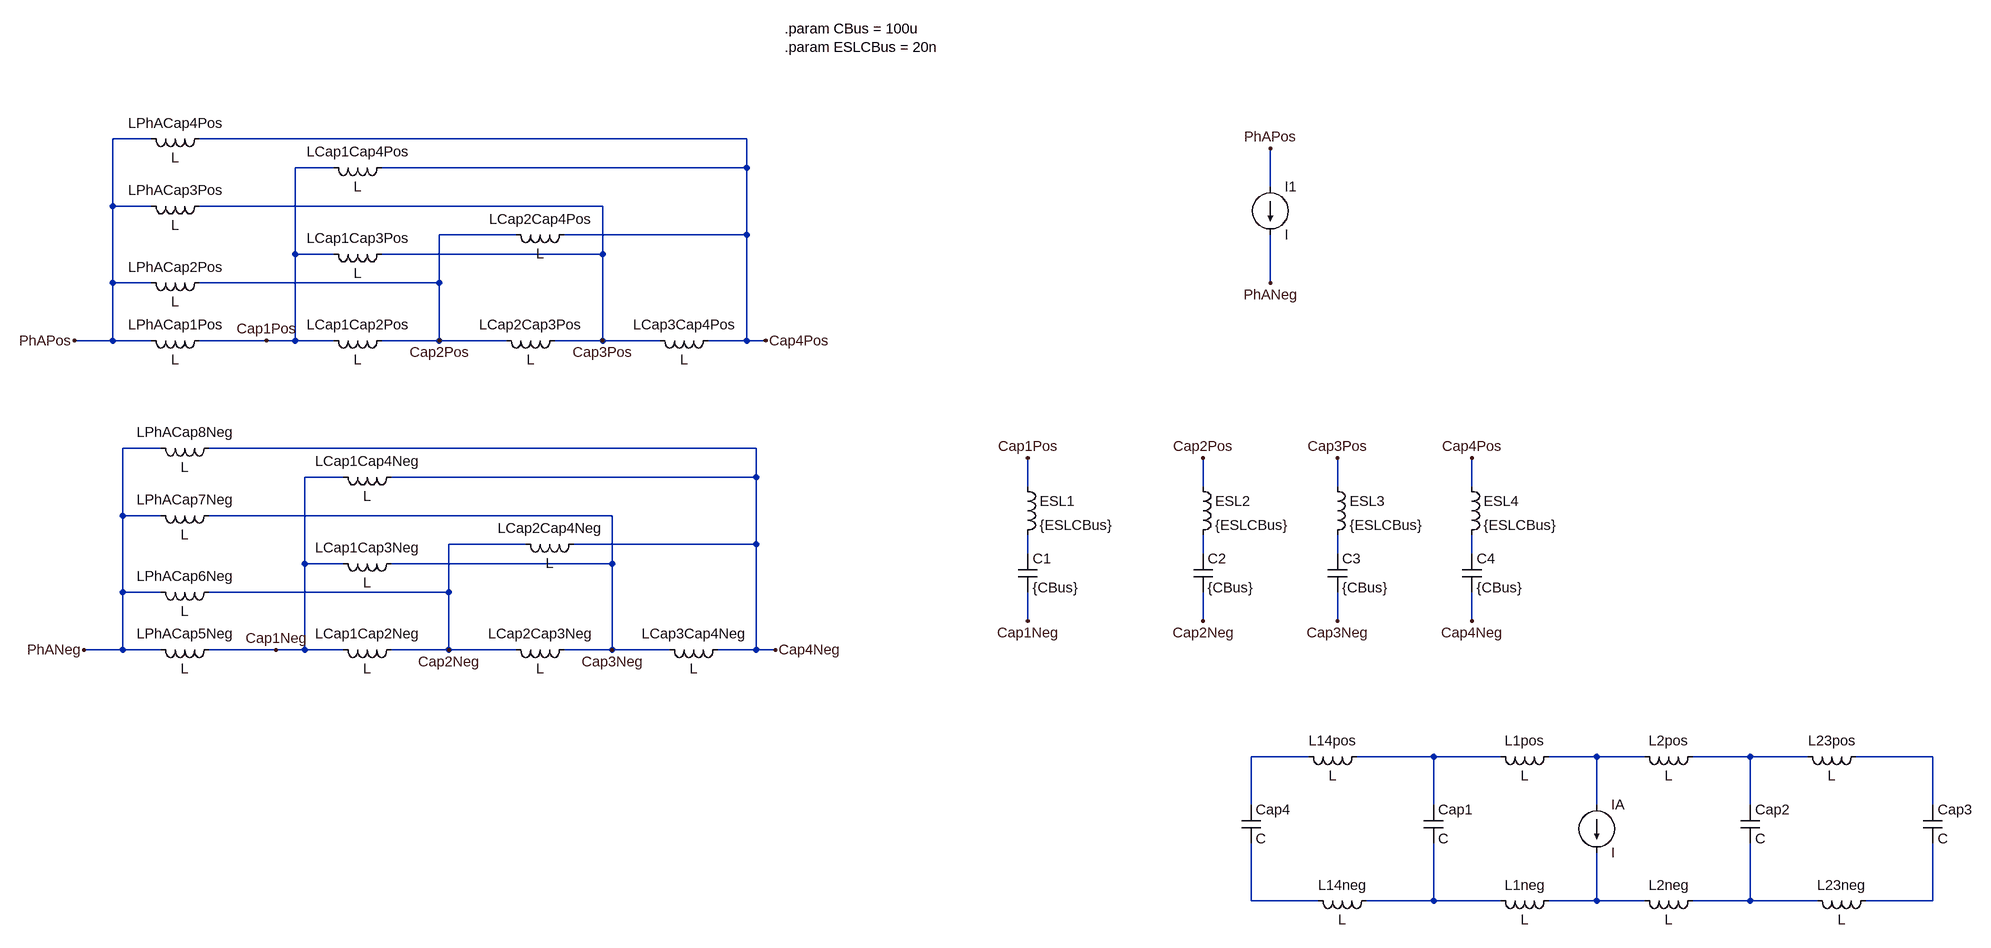
[diagram p0: schematic Draft1.asc]
Draft1.asc, the LTspice schematic file:
Version 4
SHEET 1 1544 2192
WIRE -1552 464 -1616 464
WIRE -560 464 -1472 464
WIRE -1248 512 -1312 512
WIRE -560 512 -560 464
WIRE -560 512 -1168 512
WIRE 368 544 368 480
WIRE -1616 576 -1616 464
WIRE -1552 576 -1616 576
WIRE -800 576 -1472 576
WIRE -944 624 -1072 624
WIRE -560 624 -560 512
WIRE -560 624 -864 624
WIRE -1312 656 -1312 512
WIRE -1248 656 -1312 656
WIRE -800 656 -800 576
WIRE -800 656 -1168 656
WIRE -1616 704 -1616 576
WIRE -1552 704 -1616 704
WIRE -1072 704 -1072 624
WIRE -1072 704 -1472 704
WIRE 368 704 368 624
WIRE -1616 800 -1616 704
WIRE -1616 800 -1680 800
WIRE -1552 800 -1616 800
WIRE -1360 800 -1472 800
WIRE -1312 800 -1312 656
WIRE -1312 800 -1360 800
WIRE -1248 800 -1312 800
WIRE -1072 800 -1072 704
WIRE -1072 800 -1168 800
WIRE -960 800 -1072 800
WIRE -800 800 -800 656
WIRE -800 800 -880 800
WIRE -704 800 -800 800
WIRE -560 800 -560 624
WIRE -560 800 -624 800
WIRE -528 800 -560 800
WIRE -1536 1088 -1600 1088
WIRE -544 1088 -1456 1088
WIRE -1232 1136 -1296 1136
WIRE -544 1136 -544 1088
WIRE -544 1136 -1152 1136
WIRE -48 1152 -48 1104
WIRE 256 1152 256 1104
WIRE 480 1152 480 1104
WIRE 704 1152 704 1104
WIRE -1600 1200 -1600 1088
WIRE -1536 1200 -1600 1200
WIRE -784 1200 -1456 1200
WIRE -928 1248 -1056 1248
WIRE -544 1248 -544 1136
WIRE -544 1248 -848 1248
WIRE -48 1264 -48 1232
WIRE 256 1264 256 1232
WIRE 480 1264 480 1232
WIRE 704 1264 704 1232
WIRE -1296 1280 -1296 1136
WIRE -1232 1280 -1296 1280
WIRE -784 1280 -784 1200
WIRE -784 1280 -1152 1280
WIRE -1600 1328 -1600 1200
WIRE -1536 1328 -1600 1328
WIRE -1056 1328 -1056 1248
WIRE -1056 1328 -1456 1328
WIRE -48 1376 -48 1328
WIRE 256 1376 256 1328
WIRE 480 1376 480 1328
WIRE 704 1376 704 1328
WIRE -1600 1424 -1600 1328
WIRE -1600 1424 -1664 1424
WIRE -1536 1424 -1600 1424
WIRE -1344 1424 -1456 1424
WIRE -1296 1424 -1296 1280
WIRE -1296 1424 -1344 1424
WIRE -1232 1424 -1296 1424
WIRE -1056 1424 -1056 1328
WIRE -1056 1424 -1152 1424
WIRE -944 1424 -1056 1424
WIRE -784 1424 -784 1280
WIRE -784 1424 -864 1424
WIRE -688 1424 -784 1424
WIRE -544 1424 -544 1248
WIRE -544 1424 -608 1424
WIRE -512 1424 -544 1424
WIRE 432 1904 336 1904
WIRE 640 1904 512 1904
WIRE 752 1904 640 1904
WIRE 912 1904 832 1904
WIRE 992 1904 912 1904
WIRE 1168 1904 1072 1904
WIRE 1264 1904 1168 1904
WIRE 1472 1904 1344 1904
WIRE 336 1984 336 1904
WIRE 640 1984 640 1904
WIRE 912 1984 912 1904
WIRE 1168 1984 1168 1904
WIRE 1472 1984 1472 1904
WIRE 336 2144 336 2048
WIRE 448 2144 336 2144
WIRE 640 2144 640 2048
WIRE 640 2144 528 2144
WIRE 752 2144 640 2144
WIRE 912 2144 912 2064
WIRE 912 2144 832 2144
WIRE 992 2144 912 2144
WIRE 1168 2144 1168 2048
WIRE 1168 2144 1072 2144
WIRE 1280 2144 1168 2144
WIRE 1472 2144 1472 2048
WIRE 1472 2144 1360 2144
FLAG -48 1104 Cap1Pos
FLAG 256 1104 Cap2Pos
FLAG 480 1104 Cap3Pos
FLAG 704 1104 Cap4Pos
FLAG -48 1376 Cap1Neg
FLAG 256 1376 Cap2Neg
FLAG 480 1376 Cap3Neg
FLAG 704 1376 Cap4Neg
FLAG 368 480 PhAPos
FLAG 368 704 PhANeg
FLAG -1680 800 PhAPos
FLAG -1360 800 Cap1Pos
FLAG -1072 800 Cap2Pos
FLAG -800 800 Cap3Pos
FLAG -528 800 Cap4Pos
FLAG -1664 1424 PhANeg
FLAG -1344 1424 Cap1Neg
FLAG -1056 1424 Cap2Neg
FLAG -784 1424 Cap3Neg
FLAG -512 1424 Cap4Neg
SYMBOL cap -64 1264 R0
SYMATTR InstName C1
SYMATTR Value {CBus}
SYMBOL ind -64 1136 R0
SYMATTR InstName ESL1
SYMATTR Value {ESLCBus}
SYMBOL cap 240 1264 R0
SYMATTR InstName C2
SYMATTR Value {CBus}
SYMBOL ind 240 1136 R0
SYMATTR InstName ESL2
SYMATTR Value {ESLCBus}
SYMBOL cap 464 1264 R0
SYMATTR InstName C3
SYMATTR Value {CBus}
SYMBOL ind 464 1136 R0
SYMATTR InstName ESL3
SYMATTR Value {ESLCBus}
SYMBOL cap 688 1264 R0
SYMATTR InstName C4
SYMATTR Value {CBus}
SYMBOL ind 688 1136 R0
SYMATTR InstName ESL4
SYMATTR Value {ESLCBus}
SYMBOL current 368 544 R0
SYMATTR InstName I1
SYMBOL ind -1456 784 R90
WINDOW 0 5 56 VBottom 2
WINDOW 3 32 56 VTop 2
SYMATTR InstName LPhACap1Pos
SYMBOL ind -1152 784 R90
WINDOW 0 5 56 VBottom 2
WINDOW 3 32 56 VTop 2
SYMATTR InstName LCap1Cap2Pos
SYMBOL ind -864 784 R90
WINDOW 0 5 56 VBottom 2
WINDOW 3 32 56 VTop 2
SYMATTR InstName LCap2Cap3Pos
SYMBOL ind -608 784 R90
WINDOW 0 5 56 VBottom 2
WINDOW 3 32 56 VTop 2
SYMATTR InstName LCap3Cap4Pos
SYMBOL ind -1456 688 R90
WINDOW 0 5 56 VBottom 2
WINDOW 3 32 56 VTop 2
SYMATTR InstName LPhACap2Pos
SYMBOL ind -1456 560 R90
WINDOW 0 5 56 VBottom 2
WINDOW 3 32 56 VTop 2
SYMATTR InstName LPhACap3Pos
SYMBOL ind -1456 448 R90
WINDOW 0 5 56 VBottom 2
WINDOW 3 32 56 VTop 2
SYMATTR InstName LPhACap4Pos
SYMBOL ind -1152 640 R90
WINDOW 0 5 56 VBottom 2
WINDOW 3 32 56 VTop 2
SYMATTR InstName LCap1Cap3Pos
SYMBOL ind -1152 496 R90
WINDOW 0 5 56 VBottom 2
WINDOW 3 32 56 VTop 2
SYMATTR InstName LCap1Cap4Pos
SYMBOL ind -848 608 R90
WINDOW 0 5 56 VBottom 2
WINDOW 3 32 56 VTop 2
SYMATTR InstName LCap2Cap4Pos
SYMBOL ind -1440 1408 R90
WINDOW 0 5 56 VBottom 2
WINDOW 3 32 56 VTop 2
SYMATTR InstName LPhACap5Neg
SYMBOL ind -1136 1408 R90
WINDOW 0 5 56 VBottom 2
WINDOW 3 32 56 VTop 2
SYMATTR InstName LCap1Cap2Neg
SYMBOL ind -848 1408 R90
WINDOW 0 5 56 VBottom 2
WINDOW 3 32 56 VTop 2
SYMATTR InstName LCap2Cap3Neg
SYMBOL ind -592 1408 R90
WINDOW 0 5 56 VBottom 2
WINDOW 3 32 56 VTop 2
SYMATTR InstName LCap3Cap4Neg
SYMBOL ind -1440 1312 R90
WINDOW 0 5 56 VBottom 2
WINDOW 3 32 56 VTop 2
SYMATTR InstName LPhACap6Neg
SYMBOL ind -1440 1184 R90
WINDOW 0 5 56 VBottom 2
WINDOW 3 32 56 VTop 2
SYMATTR InstName LPhACap7Neg
SYMBOL ind -1440 1072 R90
WINDOW 0 5 56 VBottom 2
WINDOW 3 32 56 VTop 2
SYMATTR InstName LPhACap8Neg
SYMBOL ind -1136 1264 R90
WINDOW 0 5 56 VBottom 2
WINDOW 3 32 56 VTop 2
SYMATTR InstName LCap1Cap3Neg
SYMBOL ind -1136 1120 R90
WINDOW 0 5 56 VBottom 2
WINDOW 3 32 56 VTop 2
SYMATTR InstName LCap1Cap4Neg
SYMBOL ind -832 1232 R90
WINDOW 0 5 56 VBottom 2
WINDOW 3 32 56 VTop 2
SYMATTR InstName LCap2Cap4Neg
SYMBOL cap 320 1984 R0
SYMATTR InstName Cap4
SYMBOL ind 528 1888 R90
WINDOW 0 5 56 VBottom 2
WINDOW 3 32 56 VTop 2
SYMATTR InstName L14pos
SYMBOL ind 544 2128 R90
WINDOW 0 5 56 VBottom 2
WINDOW 3 32 56 VTop 2
SYMATTR InstName L14neg
SYMBOL cap 624 1984 R0
SYMATTR InstName Cap1
SYMBOL ind 848 1888 R90
WINDOW 0 5 56 VBottom 2
WINDOW 3 32 56 VTop 2
SYMATTR InstName L1pos
SYMBOL ind 848 2128 R90
WINDOW 0 5 56 VBottom 2
WINDOW 3 32 56 VTop 2
SYMATTR InstName L1neg
SYMBOL ind 1088 1888 R90
WINDOW 0 5 56 VBottom 2
WINDOW 3 32 56 VTop 2
SYMATTR InstName L2pos
SYMBOL ind 1088 2128 R90
WINDOW 0 5 56 VBottom 2
WINDOW 3 32 56 VTop 2
SYMATTR InstName L2neg
SYMBOL cap 1152 1984 R0
SYMATTR InstName Cap2
SYMBOL ind 1360 1888 R90
WINDOW 0 5 56 VBottom 2
WINDOW 3 32 56 VTop 2
SYMATTR InstName L23pos
SYMBOL ind 1376 2128 R90
WINDOW 0 5 56 VBottom 2
WINDOW 3 32 56 VTop 2
SYMATTR InstName L23neg
SYMBOL cap 1456 1984 R0
SYMATTR InstName Cap3
SYMBOL current 912 1984 R0
SYMATTR InstName IA
TEXT -496 -40 Left 2 !.param CBus = 100u\n.param ESLCBus = 20n

The netlist it stands for:
* Draft1.asc
C1 N001 Cap1Neg {CBus}
L§ESL1 Cap1Pos N001 {ESLCBus}
C2 N002 Cap2Neg {CBus}
L§ESL2 Cap2Pos N002 {ESLCBus}
C3 N003 Cap3Neg {CBus}
L§ESL3 Cap3Pos N003 {ESLCBus}
C4 N004 Cap4Neg {CBus}
L§ESL4 Cap4Pos N004 {ESLCBus}
I1 PhAPos PhANeg I
LPhACap1Pos Cap1Pos PhAPos L
LCap1Cap2Pos Cap2Pos Cap1Pos L
LCap2Cap3Pos Cap3Pos Cap2Pos L
LCap3Cap4Pos Cap4Pos Cap3Pos L
LPhACap2Pos Cap2Pos PhAPos L
LPhACap3Pos Cap3Pos PhAPos L
LPhACap4Pos Cap4Pos PhAPos L
LCap1Cap3Pos Cap3Pos Cap1Pos L
LCap1Cap4Pos Cap4Pos Cap1Pos L
LCap2Cap4Pos Cap4Pos Cap2Pos L
LPhACap5Neg Cap1Neg PhANeg L
LCap1Cap2Neg Cap2Neg Cap1Neg L
LCap2Cap3Neg Cap3Neg Cap2Neg L
LCap3Cap4Neg Cap4Neg Cap3Neg L
LPhACap6Neg Cap2Neg PhANeg L
LPhACap7Neg Cap3Neg PhANeg L
LPhACap8Neg Cap4Neg PhANeg L
LCap1Cap3Neg Cap3Neg Cap1Neg L
LCap1Cap4Neg Cap4Neg Cap1Neg L
LCap2Cap4Neg Cap4Neg Cap2Neg L
Cap4 N005 N010 C
L14pos N006 N005 L
L14neg N011 N010 L
Cap1 N006 N011 C
L1pos N007 N006 L
L1neg N012 N011 L
L2pos N008 N007 L
L2neg N013 N012 L
Cap2 N008 N013 C
L23pos N009 N008 L
L23neg N014 N013 L
Cap3 N009 N014 C
IA N007 N012 I
.param CBus = 100u
.param ESLCBus = 20n
.backanno
.end